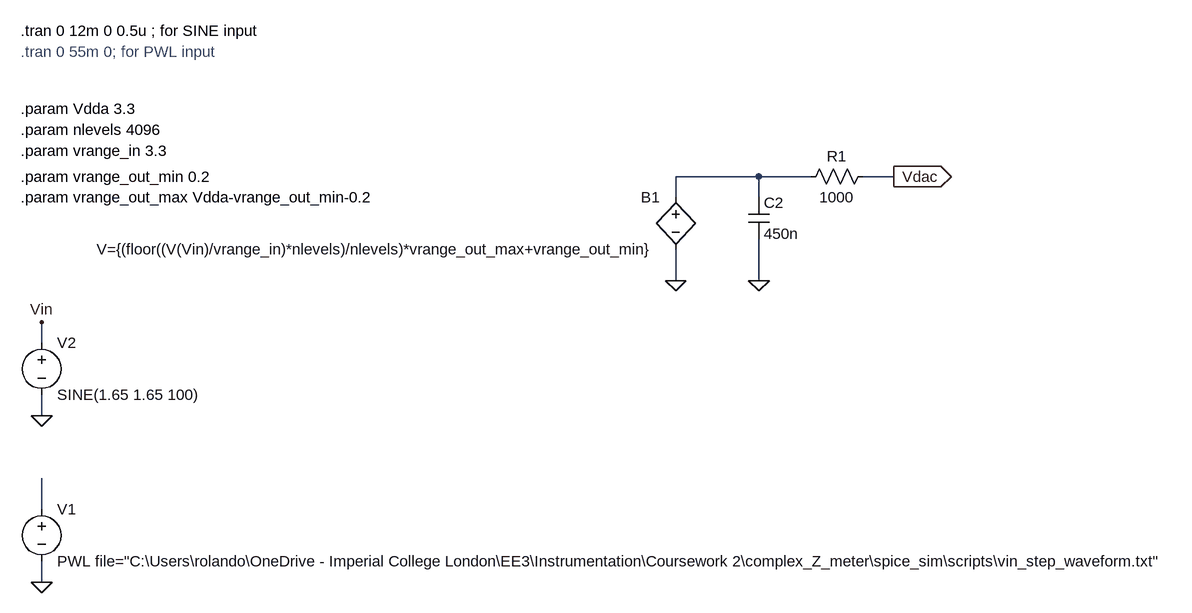
[diagram p0: schematic dac.asc]
dac.asc, the LTspice schematic file:
Version 4
SHEET 1 1824 724
WIRE 336 80 208 80
WIRE 416 80 336 80
WIRE 544 80 496 80
WIRE 208 112 208 80
WIRE 336 112 336 80
WIRE 208 240 208 192
WIRE 336 240 336 176
WIRE -768 336 -768 304
WIRE -768 448 -768 416
WIRE -768 592 -768 544
WIRE -768 704 -768 672
FLAG 544 80 Vdac
IOPIN 544 80 Out
FLAG 208 240 0
FLAG -768 304 Vin
FLAG -768 704 0
FLAG -768 448 0
FLAG 336 240 0
SYMBOL bv 208 96 M0
SYMATTR InstName B1
SYMATTR Value V={(floor((V(Vin)/vrange_in)*nlevels)/nlevels)*vrange_out_max+vrange_out_min}
SYMBOL voltage -768 576 R0
WINDOW 123 0 0 Left 0
WINDOW 39 0 0 Left 0
SYMATTR InstName V1
SYMATTR Value PWL file="C:\Users\rolando\OneDrive - Imperial College London\EE3\Instrumentation\Coursework 2\complex_Z_meter\spice_sim\scripts\vin_step_waveform.txt"
SYMBOL res 512 64 R90
WINDOW 0 0 56 VBottom 2
WINDOW 3 32 56 VTop 2
SYMATTR InstName R1
SYMATTR Value 1000
SYMBOL voltage -768 320 R0
WINDOW 123 0 0 Left 0
WINDOW 39 0 0 Left 0
SYMATTR InstName V2
SYMATTR Value SINE(1.65 1.65 100)
SYMBOL cap 320 112 R0
SYMATTR InstName C2
SYMATTR Value 450n
TEXT -800 8 Left 2 !.param nlevels 4096
TEXT -800 40 Left 2 !.param vrange_in 3.3
TEXT -800 -112 Left 2 ;.tran 0 55m 0; for PWL input
TEXT -800 112 Left 2 !.param vrange_out_max Vdda-vrange_out_min-0.2
TEXT -800 80 Left 2 !.param vrange_out_min 0.2
TEXT -800 -24 Left 2 !.param Vdda 3.3
TEXT -800 -144 Left 2 !.tran 0 12m 0 0.5u ; for SINE input

The netlist it stands for:
* dac.asc
B1 N001 0 V={(floor((V(Vin)/vrange_in)*nlevels)/nlevels)*vrange_out_max+vrange_out_min}
V1 N002 0 PWL file="C:\Users\rolando\OneDrive - Imperial College London\EE3\Instrumentation\Coursework 2\complex_Z_meter\spice_sim\scripts\vin_step_waveform.txt"
R1 Vdac N001 1000
V2 Vin 0 SINE(1.65 1.65 100)
C2 N001 0 450n
.param nlevels 4096
.param vrange_in 3.3
* .tran 0 55m 0; for PWL input
.param vrange_out_max Vdda-vrange_out_min-0.2
.param vrange_out_min 0.2
.param Vdda 3.3
.tran 0 12m 0 0.5u ; for SINE input
.backanno
.end